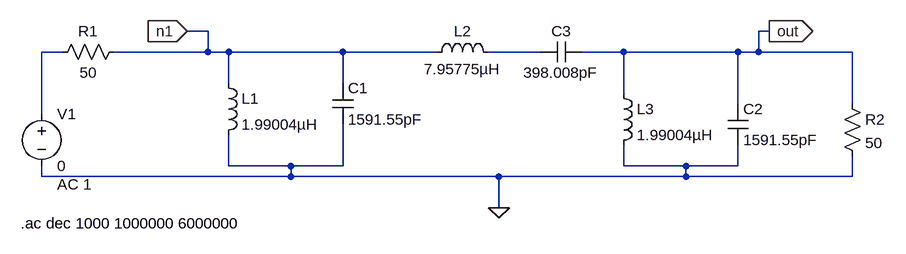
[diagram p0: schematic 2_8_MHz_BPF.asc]
2_8_MHz_BPF.asc, the LTspice schematic file:
Version 4.1
SHEET 1 1240 680
WIRE 192 16 160 16
WIRE 1056 16 1040 16
WIRE -32 48 -64 48
WIRE 192 48 192 16
WIRE 192 48 48 48
WIRE 224 48 192 48
WIRE 400 48 224 48
WIRE 544 48 400 48
WIRE 704 48 624 48
WIRE 832 48 768 48
WIRE 1008 48 832 48
WIRE 1040 48 1040 16
WIRE 1040 48 1008 48
WIRE 1184 48 1040 48
WIRE 224 96 224 48
WIRE 400 96 400 48
WIRE 832 112 832 48
WIRE 1008 128 1008 48
WIRE 1184 128 1184 48
WIRE -64 144 -64 48
WIRE 224 224 224 176
WIRE 320 224 224 224
WIRE 400 224 400 160
WIRE 400 224 320 224
WIRE 832 224 832 192
WIRE 928 224 832 224
WIRE 1008 224 1008 192
WIRE 1008 224 928 224
WIRE -64 240 -64 224
WIRE 320 240 320 224
WIRE 320 240 -64 240
WIRE 640 240 320 240
WIRE 928 240 928 224
WIRE 928 240 640 240
WIRE 1184 240 1184 208
WIRE 1184 240 928 240
WIRE 640 288 640 240
FLAG 640 288 0
FLAG 160 16 n1
IOPIN 160 16 In
FLAG 1056 16 out
IOPIN 1056 16 Out
SYMBOL voltage -64 128 R0
WINDOW 123 24 124 Left 2
WINDOW 39 0 0 Left 0
SYMATTR InstName V1
SYMATTR Value 0
SYMATTR Value2 AC 1
SYMBOL res 64 32 R90
WINDOW 0 0 56 VBottom 2
WINDOW 3 32 56 VTop 2
SYMATTR InstName R1
SYMATTR Value 50
SYMBOL ind 208 80 R0
SYMATTR InstName L1
SYMATTR Value 1.99004µH
SYMBOL cap 384 96 R0
SYMATTR InstName C1
SYMATTR Value 1591.55pF
SYMBOL ind 528 64 R270
WINDOW 0 32 56 VTop 2
WINDOW 3 5 56 VBottom 2
SYMATTR InstName L2
SYMATTR Value 7.95775µH
SYMBOL cap 992 128 R0
SYMATTR InstName C2
SYMATTR Value 1591.55pF
SYMBOL ind 816 96 R0
SYMATTR InstName L3
SYMATTR Value 1.99004µH
SYMBOL cap 768 32 R90
WINDOW 0 0 32 VBottom 2
WINDOW 3 32 32 VTop 2
SYMATTR InstName C3
SYMATTR Value 398.008pF
SYMBOL res 1168 112 R0
SYMATTR InstName R2
SYMATTR Value 50
TEXT -96 312 Left 2 !.ac dec 1000 1000000 6000000

The netlist it stands for:
* 2_8_MHz_BPF.asc
V1 N001 0 0 AC 1
R1 n1 N001 50
L1 n1 0 1.99004µH
C1 n1 0 1591.55pF
L2 n1 N002 7.95775µH
C2 out 0 1591.55pF
L3 out 0 1.99004µH
C3 out N002 398.008pF
R2 out 0 50
.ac dec 1000 1000000 6000000
.backanno
.end